# EAGLE design BMS Adapter rev5 (EAGLE 9.5.0)
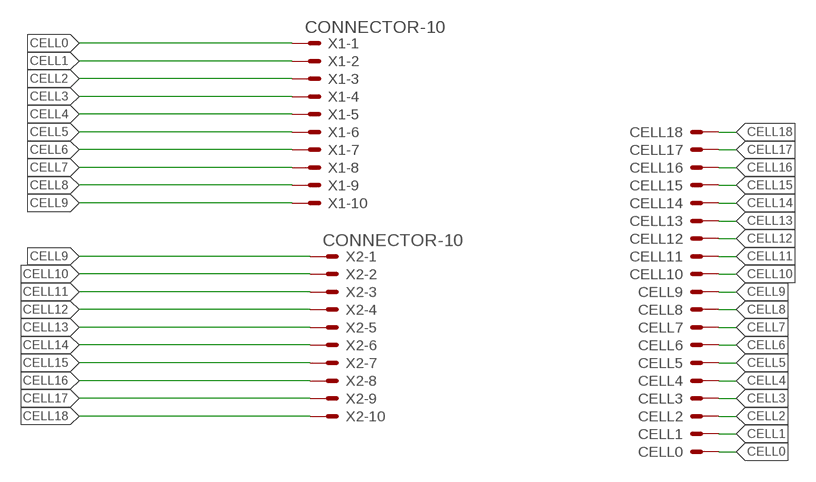
[diagram p0: schematic, sheet 1]

## Parts
CELL0  BATTERY_SPRING  [KEYSTONE5203]
CELL1  BATTERY_SPRING  [KEYSTONE5203]
CELL2  BATTERY_SPRING  [KEYSTONE5203]
CELL3  BATTERY_SPRING  [KEYSTONE5203]
CELL4  BATTERY_SPRING  [KEYSTONE5203]
CELL5  BATTERY_SPRING  [KEYSTONE5203]
CELL6  BATTERY_SPRING  [KEYSTONE5203]
CELL7  BATTERY_SPRING  [KEYSTONE5203]
CELL8  BATTERY_SPRING  [KEYSTONE5203]
CELL9  BATTERY_SPRING  [KEYSTONE5203]
CELL10  BATTERY_SPRING  [KEYSTONE5203]
CELL11  BATTERY_SPRING  [KEYSTONE5203]
CELL12  BATTERY_SPRING  [KEYSTONE5203]
CELL13  BATTERY_SPRING  [KEYSTONE5203]
CELL14  BATTERY_SPRING  [KEYSTONE5203]
CELL15  BATTERY_SPRING  [KEYSTONE5203]
CELL16  BATTERY_SPRING  [KEYSTONE5203]
CELL17  BATTERY_SPRING  [KEYSTONE5203]
CELL18  BATTERY_SPRING  [KEYSTONE5203]
X1  CONNECTOR-10  [MINIFIT_5566-10]
X2  CONNECTOR-10  [MINIFIT_5566-10]

## Nets
CELL0: CELL0.P$1(S) X1.1
CELL1: CELL1.P$1(S) X1.2
CELL2: CELL2.P$1(S) X1.3
CELL3: CELL3.P$1(S) X1.4
CELL4: CELL4.P$1(S) X1.5
CELL5: CELL5.P$1(S) X1.6
CELL6: CELL6.P$1(S) X1.7
CELL7: CELL7.P$1(S) X1.8
CELL8: CELL8.P$1(S) X1.9
CELL9: CELL9.P$1(S) X1.10 X2.1
CELL10: CELL10.P$1(S) X2.2
CELL11: CELL11.P$1(S) X2.3
CELL12: CELL12.P$1(S) X2.4
CELL13: CELL13.P$1(S) X2.5
CELL14: CELL14.P$1(S) X2.6
CELL15: CELL15.P$1(S) X2.7
CELL16: CELL16.P$1(S) X2.8
CELL17: CELL17.P$1(S) X2.9
CELL18: CELL18.P$1(S) X2.10

## Library data of the parts
CELL0 CELL1-CELL18 = HyTechDevices:BATTERY_SPRING: Keystone Electronics Battery Spring Contact Datasheet <http://keyelco.com/userAssets/file/M65p17.pdf>
X1 X2 = HyTechDevices:CONNECTOR-10: Mini-Fit Junior connector 10 pole Source: http://www.molex.com; OC_FARNELL: unknown; OC_NEWARK: unknown

## Board
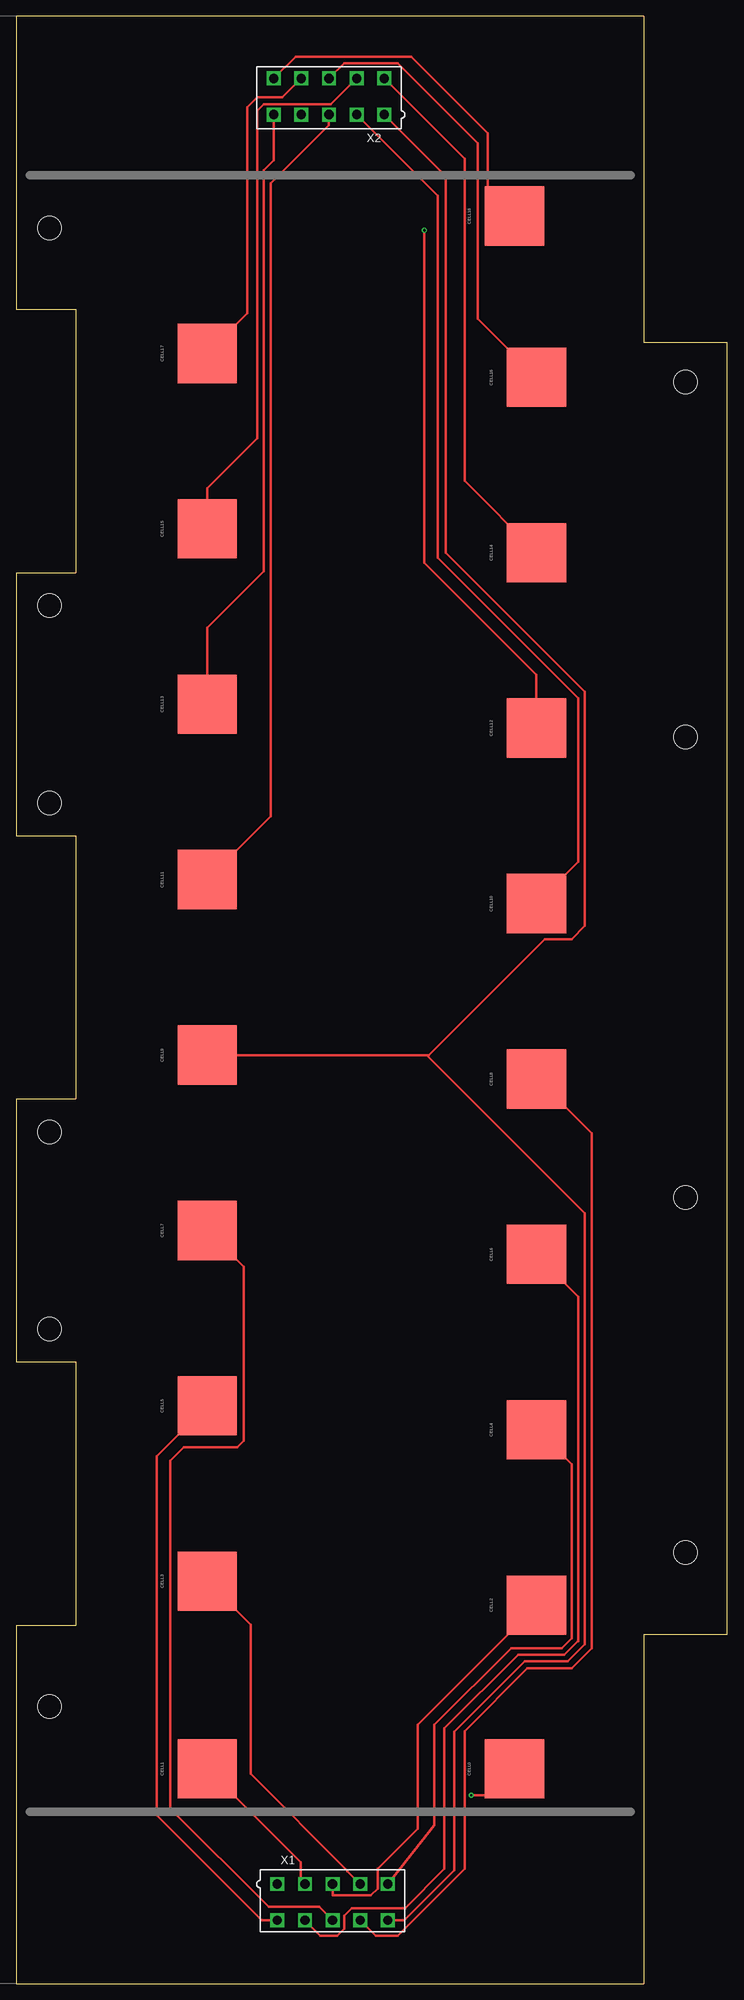
[diagram p1: board, top side]
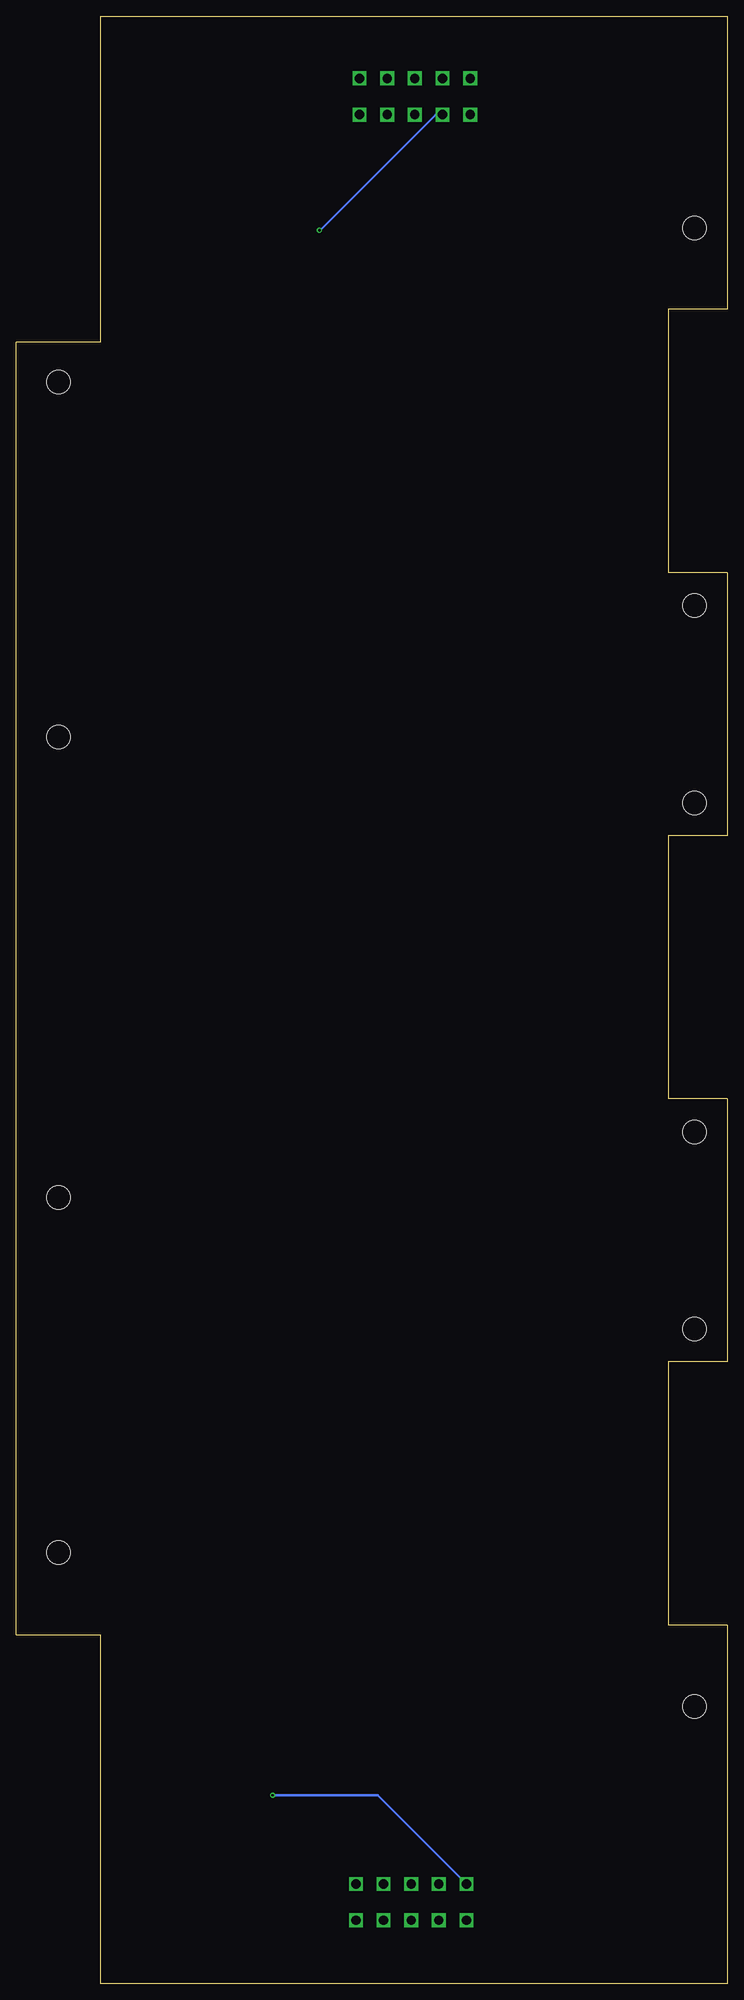
[diagram p2: board, bottom side, seen from below]

Size 108 x 298.84 mm. Coordinates in mm from the lower left corner, seen from the top.
Outline: 9,254.32 9,214.32 0,214.32 0,174.38 9,174.38 9,134.38 0,134.38 0,94.44 9,94.44 9,54.44 0,54.44 0,0 95.3,0 95.3,53 108,53 108,249.31 95.3,249.31 95.3,298.84 0,298.84 0,254.32 9,254.32
Copper layers (1*16): Top 0.035mm / dielectric 1.5mm / Bottom 0.035mm
Design rules "default": minimum track width 6mil, minimum drill 0.35mm, track to track 6mil, track to pad 6mil, pad to pad 6mil, via to via 6mil, smd to smd 6mil, copper to edge 40mil, drill to drill 6mil, minimum pad ring 10mil, minimum via ring 8mil, stop-mask expansion 4mil, vias tented up to drill 0mil, thermal gap 10mil
Holes 3.6 mm at 5,266.71 5,209.33 5,179.38 5,129.38 5,99.44 5,42.06 101.65,65.46 101.65,119.38 101.65,189.38 101.65,243.31

### Footprints (pad centres in the part's own frame; a part is rotated, then mirrored left to right if it is on the bottom)
KEYSTONE5203 = smd 9 x 9: P$1 0,0
MINIFIT_5566-10 = drill 1.4 square: 1 8.4,-2.75; 2 4.2,-2.75; 3 0,-2.75; 4 -4.2,-2.75; 5 -8.4,-2.75; 6 8.4,2.75; 7 4.2,2.75; 8 0,2.75; 9 -4.2,2.75; 10 -8.4,2.75

### Placement (x,y rotation side)
CELL0  75.66,32.64 270 top
CELL1  29,32.64 270 top
CELL2  79,57.49 270 top
CELL3  29,61.12 270 top
CELL4  79,84.14 270 top
CELL5  29,87.76 270 top
CELL6  79,110.79 270 top
CELL7  29,114.41 270 top
CELL8  79,137.43 270 top
CELL9  29,141.06 270 top
CELL10  79,164.08 270 top
CELL11  29,167.71 270 top
CELL12  79,190.73 270 top
CELL13  29,194.35 270 top
CELL14  79,217.38 270 top
CELL15  29,221 270 top
CELL16  79,244.02 270 top
CELL17  29,247.65 270 top
CELL18  75.66,268.53 270 top
X1  48.03,12.36 180 top
X2  47.48,286.68 0 top

### Tracks (layer width: path | path; a pad name or v marks a point on that pad's centre or on a via)
CELL0  (via drill 0.35)
  Top 0.406: CELL0.P$1 71.64,28.62 v69.09,28.62
  Bottom 0.406: X1.1 53.13,28.62 v69.09,28.62
CELL1
  Top 0.406: X1.2 43.18,15.76 43.18,18.46 29.46,32.17 CELL1.P$1
CELL2
  Top 0.406: CELL2.P$1 78.74,57.06 60.96,39.28 60.96,23.54 54.86,17.44 54.86,14.39 53.85,13.38 48.03,13.38 X1.3
CELL3
  Top 0.406: CELL3.P$1 29.46,60.62 35.56,54.52 35.56,31.84 50.26,17.14 50.26,17.08 X1.4
CELL4
  Top 0.406: X1.5 63.5,24.04 63.5,39.28 75.18,50.97 82.8,50.97 84.33,52.49 84.33,78.91 79.25,83.99 CELL4.P$1
CELL5
  Top 0.406: CELL5.P$1 21.34,80.1 21.34,25.57 37.29,9.61 X1.6
CELL6
  Top 0.406: CELL6.P$1 79.25,110.4 85.34,104.31 85.34,51.98 85.26,51.98 83.22,49.95 76.2,49.95 65.02,38.78 65.02,17.44 59.06,11.47 50.93,11.47 49.78,10.33 49.78,8.3 48.77,7.28 46.16,7.28 X1.7
CELL7
  Top 0.406: X1.8 45.99,11.64 38.31,11.64 23.37,26.58 23.37,79.42 25.4,81.45 33.53,81.45 34.54,82.46 34.54,108.87 CELL7.P$1
CELL8
  Top 0.406: X1.9 54.56,7.28 57.91,7.28 68.07,17.44 68.07,38.36 77.64,47.92 84.33,47.92 87.38,50.97 87.38,129.2 79.25,137.33 CELL8.P$1
CELL9
  Top 0.406: X2.1 65.25,274.55 65.25,217.36 86.36,196.26 86.36,160.7 84.33,158.66 80.26,158.66 62.66,141.06 62.31,141.06 | CELL9.P$1 62.31,141.06 | 62.31,141.06 86.36,117.01 86.36,51.56 83.73,48.94 77.22,48.94 66.53,38.26 66.53,17.22 58.93,9.61 X1.10
CELL10
  Top 0.406: CELL10.P$1 85.34,170.42 85.34,195.24 64.01,216.58 64.01,271.6 X2.2
CELL11
  Top 0.406: CELL11.P$1 38.61,177.32 38.61,273.47 47.48,282.34 X2.3
CELL12  (via drill 0.38)
  Top 0.406: CELL12.P$1 79,198.86 61.98,215.88 v61.98,266.36
  Bottom 0.406: v61.98,266.36 61.86,266.36 44.29,283.93 X2.4
CELL13
  Top 0.406: CELL13.P$1 29,205.95 37.59,214.54 37.59,275.5 39.08,276.99 X2.5
CELL14
  Top 0.406: CELL14.P$1 68.07,228.31 68.07,277.24 X2.6
CELL15
  Top 0.406: CELL15.P$1 29,227.2 36.58,234.78 36.58,284.52 37.59,285.54 47.78,285.54 X2.7
CELL16
  Top 0.406: CELL16.P$1 70.1,252.92 70.1,279.57 57.91,291.76 49.81,291.76 X2.8
CELL17
  Top 0.406: CELL17.P$1 35.1,253.75 35.1,285.07 36.58,286.55 40.4,286.55 X2.9
CELL18
  Top 0.406: CELL18.P$1 71.6,272.59 71.6,281.12 59.97,292.75 42.4,292.75 X2.10

### Text on the board
tDocu: Mode B | DO NOT MIX A & B | Mohammed / Arif | DANGER HIGH VOLTAGE | BMS Enerdel Adapter 2019 rev4 | DANGER HIGH VOLTAGE | Warning: Only install Mode A or Mode B connectors / DO NOT MIX | Mode A